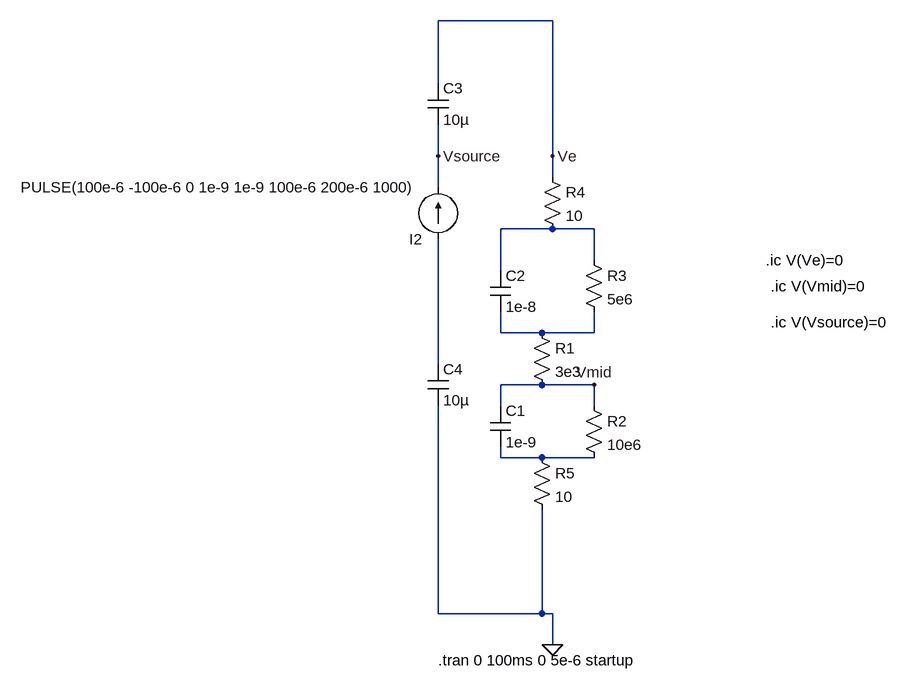
[diagram p0: schematic biphasic_triphasic_DC_block.asc]
biphasic_triphasic_DC_block.asc, the LTspice schematic file:
Version 4
SHEET 1 1384 680
WIRE 176 -480 0 -480
WIRE 0 -384 0 -480
WIRE 0 -272 0 -320
WIRE 176 -272 176 -480
WIRE 176 -240 176 -272
WIRE 0 -224 0 -272
WIRE 176 -160 96 -160
WIRE 240 -160 176 -160
WIRE 240 -112 240 -160
WIRE 96 -96 96 -160
WIRE 96 0 96 -32
WIRE 160 0 96 0
WIRE 240 0 240 -32
WIRE 240 0 160 0
WIRE 0 48 0 -144
WIRE 160 80 96 80
WIRE 240 80 160 80
WIRE 96 112 96 80
WIRE 240 112 240 80
WIRE 96 192 96 176
WIRE 160 192 96 192
WIRE 240 192 160 192
WIRE 0 432 0 112
WIRE 160 432 160 272
WIRE 160 432 0 432
WIRE 176 432 160 432
WIRE 176 480 176 432
FLAG 176 480 0
FLAG 176 -272 Ve
FLAG 240 80 Vmid
FLAG 0 -272 Vsource
SYMBOL cap 80 112 R0
SYMATTR InstName C1
SYMATTR Value 1e-9
SYMBOL cap 80 -96 R0
SYMATTR InstName C2
SYMATTR Value 1e-8
SYMBOL res 144 -16 R0
SYMATTR InstName R1
SYMATTR Value 3e3
SYMBOL res 224 96 R0
SYMATTR InstName R2
SYMATTR Value 10e6
SYMBOL res 224 -128 R0
SYMATTR InstName R3
SYMATTR Value 5e6
SYMBOL res 160 -256 R0
SYMATTR InstName R4
SYMATTR Value 10
SYMATTR SpiceLine tol=1 pwr=1
SYMBOL res 144 176 R0
SYMATTR InstName R5
SYMATTR Value 10
SYMBOL current 0 -144 R180
WINDOW 123 0 0 Left 2
WINDOW 39 0 0 Left 2
SYMATTR InstName I2
SYMATTR Value PULSE(100e-6 -100e-6 0 1e-9 1e-9 100e-6 200e-6 1000)
SYMBOL cap -16 -384 R0
SYMATTR InstName C3
SYMATTR Value 10µ
SYMBOL cap -16 48 R0
SYMATTR InstName C4
SYMATTR Value 10µ
TEXT 0 504 Left 2 !.tran 0 100ms 0 5e-6 startup
TEXT 504 -112 Left 2 !.ic V(Ve)=0
TEXT 512 -72 Left 2 !.ic V(Vmid)=0
TEXT 512 -16 Left 2 !.ic V(Vsource)=0

The netlist it stands for:
* biphasic_triphasic_DC_block.asc
C1 Vmid N004 1e-9
C2 N001 N002 1e-8
R1 N002 Vmid 3e3
R2 Vmid N004 10e6
R3 N001 N002 5e6
R4 Ve N001 10 tol=1 pwr=1
R5 N004 0 10
I2 N003 Vsource PULSE(100e-6 -100e-6 0 1e-9 1e-9 100e-6 200e-6 1000)
C3 Ve Vsource 10µ
C4 N003 0 10µ
.tran 0 100ms 0 5e-6 startup
.ic V(Ve)=0
.ic V(Vmid)=0
.ic V(Vsource)=0
.backanno
.end